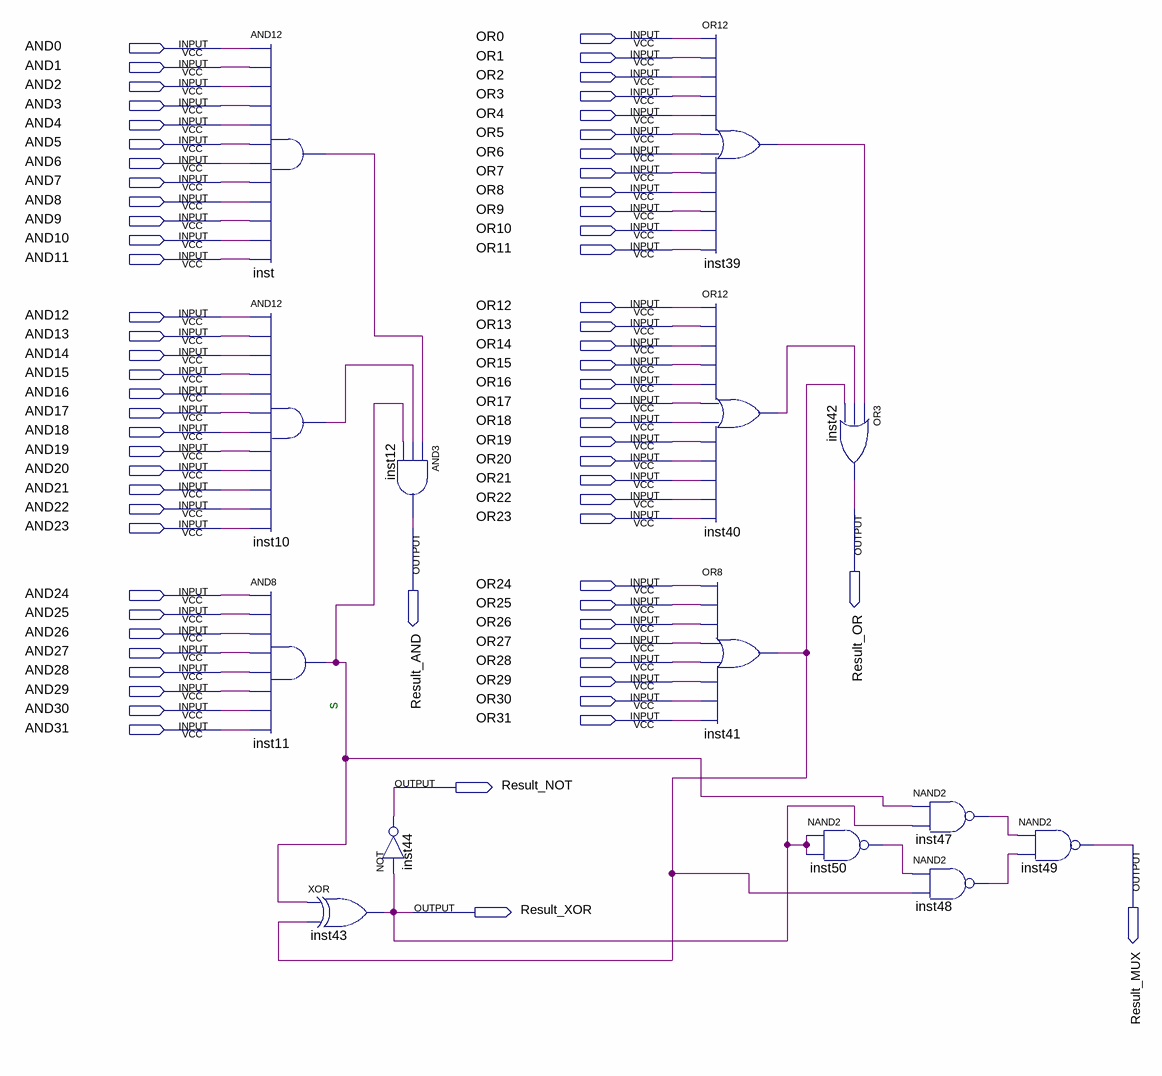
[diagram p0: schematic sheet]
// Quartus schematic tklls.bdf as structural Verilog: 14 symbols, 69 pins
module tklls (
  input  OR0,
  input  AND0,
  input  OR1,
  input  AND1,
  input  OR2,
  input  AND2,
  input  OR3,
  input  AND3,
  input  OR4,
  input  AND4,
  input  OR5,
  input  AND5,
  input  OR6,
  input  AND6,
  input  OR7,
  input  AND7,
  input  OR8,
  input  AND8,
  input  OR9,
  input  AND9,
  input  OR10,
  input  AND10,
  input  OR11,
  input  AND11,
  input  OR12,
  input  AND12,
  input  OR13,
  input  AND13,
  input  OR14,
  input  AND14,
  input  OR15,
  input  AND15,
  input  OR16,
  input  AND16,
  input  OR17,
  input  AND17,
  input  OR18,
  input  AND18,
  input  OR19,
  input  AND19,
  input  OR20,
  input  AND20,
  input  OR21,
  input  AND21,
  input  OR22,
  input  AND22,
  input  OR23,
  input  AND23,
  input  OR24,
  input  AND24,
  input  OR25,
  input  AND25,
  input  OR26,
  input  AND26,
  input  OR27,
  input  AND27,
  input  OR28,
  input  AND28,
  input  OR29,
  input  AND29,
  input  OR30,
  input  AND30,
  input  OR31,
  input  AND31,
  output Result_OR,
  output Result_AND,
  output Result_NOT,
  output Result_MUX,
  output Result_XOR
);

  wire inst10_out, inst11_out, inst39_out, inst40_out, inst41_out, inst47_out, inst48_out, inst50_out,
       inst_out;

  and inst (inst_out, AND0, AND1, AND2, AND3, AND4, AND5, AND6, AND7, AND8, AND9, AND10, AND11);
  and inst10 (inst10_out, AND12, AND13, AND14, AND15, AND16, AND17, AND18, AND19, AND20, AND21, AND22, AND23);
  and inst11 (inst11_out, AND24, AND25, AND26, AND27, AND28, AND29, AND30, AND31);
  xor inst43 (Result_XOR, inst11_out, inst41_out);
  and inst12 (Result_AND, inst_out, inst10_out, inst11_out);
  not inst44 (Result_NOT, Result_XOR);
  or inst39 (inst39_out, OR0, OR1, OR2, OR3, OR4, OR5, OR6, OR7, OR8, OR9, OR10, OR11);
  or inst40 (inst40_out, OR12, OR13, OR14, OR15, OR16, OR17, OR18, OR19, OR20, OR21, OR22, OR23);
  or inst41 (inst41_out, OR24, OR25, OR26, OR27, OR28, OR29, OR30, OR31);
  nand inst50 (inst50_out, Result_XOR, Result_XOR);
  or inst42 (Result_OR, inst39_out, inst40_out, inst41_out);
  nand inst47 (inst47_out, inst11_out, Result_XOR);
  nand inst48 (inst48_out, inst50_out, inst41_out);
  nand inst49 (Result_MUX, inst47_out, inst48_out);

  // Notes on the sheet:
  //   s
endmodule
